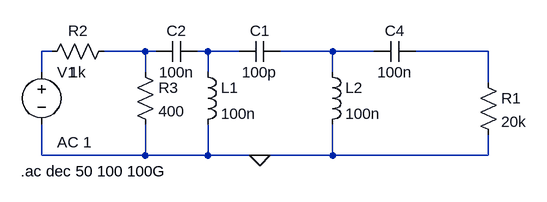
[diagram p0: schematic realim-hartley.asc]
realim-hartley.asc, the LTspice schematic file:
Version 4
SHEET 1 880 680
WIRE -112 64 -128 64
WIRE 32 64 -32 64
WIRE 48 64 32 64
WIRE 128 64 112 64
WIRE 176 64 128 64
WIRE 320 64 240 64
WIRE 384 64 320 64
WIRE 560 64 448 64
WIRE -128 96 -128 64
WIRE 32 96 32 64
WIRE 128 96 128 64
WIRE 320 96 320 64
WIRE 560 112 560 64
WIRE -128 224 -128 176
WIRE 32 224 32 176
WIRE 32 224 -128 224
WIRE 128 224 128 176
WIRE 128 224 32 224
WIRE 208 224 128 224
WIRE 320 224 320 176
WIRE 320 224 208 224
WIRE 560 224 560 192
WIRE 560 224 320 224
FLAG 208 224 0
SYMBOL voltage -128 80 R0
WINDOW 123 24 124 Left 2
WINDOW 39 0 0 Left 0
SYMATTR Value2 AC 1
SYMATTR InstName V1
SYMATTR Value ""
SYMBOL cap 448 48 R90
WINDOW 0 0 32 VBottom 2
WINDOW 3 32 32 VTop 2
SYMATTR InstName C4
SYMATTR Value 100n
SYMBOL res 544 96 R0
SYMATTR InstName R1
SYMATTR Value 20k
SYMBOL res -16 48 R90
WINDOW 0 0 56 VBottom 2
WINDOW 3 32 56 VTop 2
SYMATTR InstName R2
SYMATTR Value 1k
SYMBOL res 16 80 R0
SYMATTR InstName R3
SYMATTR Value 400
SYMBOL ind 112 80 R0
SYMATTR InstName L1
SYMATTR Value 100n
SYMBOL ind 304 80 R0
SYMATTR InstName L2
SYMATTR Value 100n
SYMBOL cap 240 48 R90
WINDOW 0 0 32 VBottom 2
WINDOW 3 32 32 VTop 2
SYMATTR InstName C1
SYMATTR Value 100p
SYMBOL cap 112 48 R90
WINDOW 0 0 32 VBottom 2
WINDOW 3 32 32 VTop 2
SYMATTR InstName C2
SYMATTR Value 100n
TEXT -160 248 Left 2 !.ac dec 50 100 100G

The netlist it stands for:
* realim-hartley.asc
V1 N001 0 AC 1
C4 N005 N004 100n
R1 N005 0 20k
R2 N002 N001 1k
R3 N002 0 400
L1 N003 0 100n
L2 N004 0 100n
C1 N004 N003 100p
C2 N003 N002 100n
.ac dec 50 100 100G
.backanno
.end